# EAGLE board Arduino_fuer_LEDs_DCC_1.8 (EAGLE 9.6.2)
RELEASE_DATE: 07.11.22; RELEASE_VER: 1.8
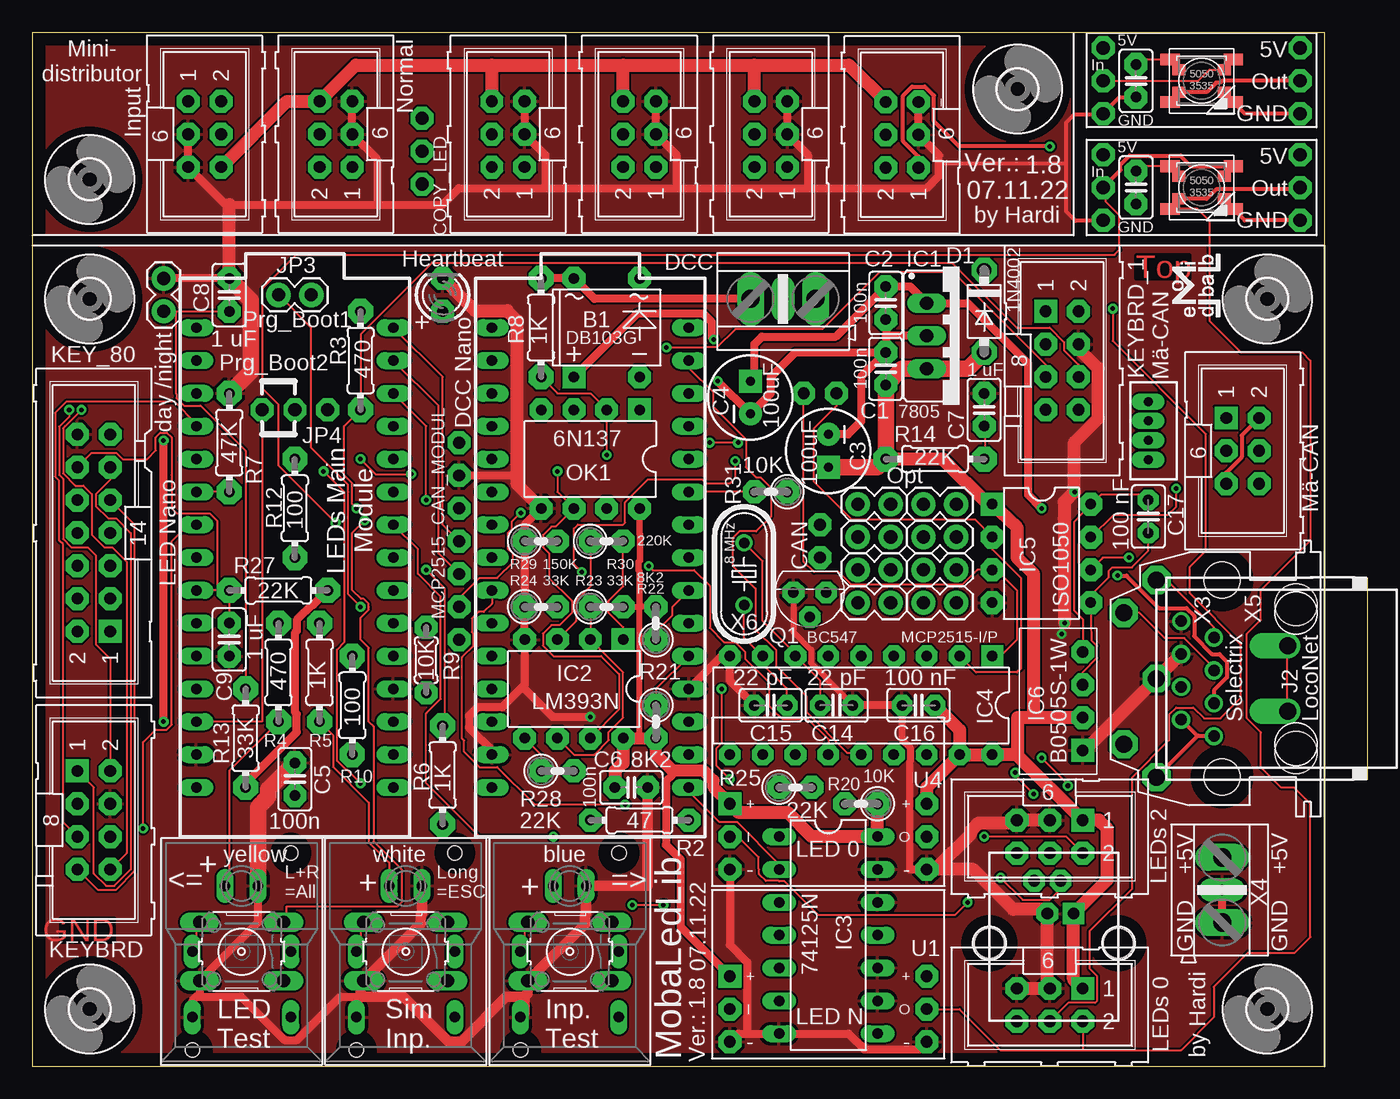
[diagram p2: board, top side]
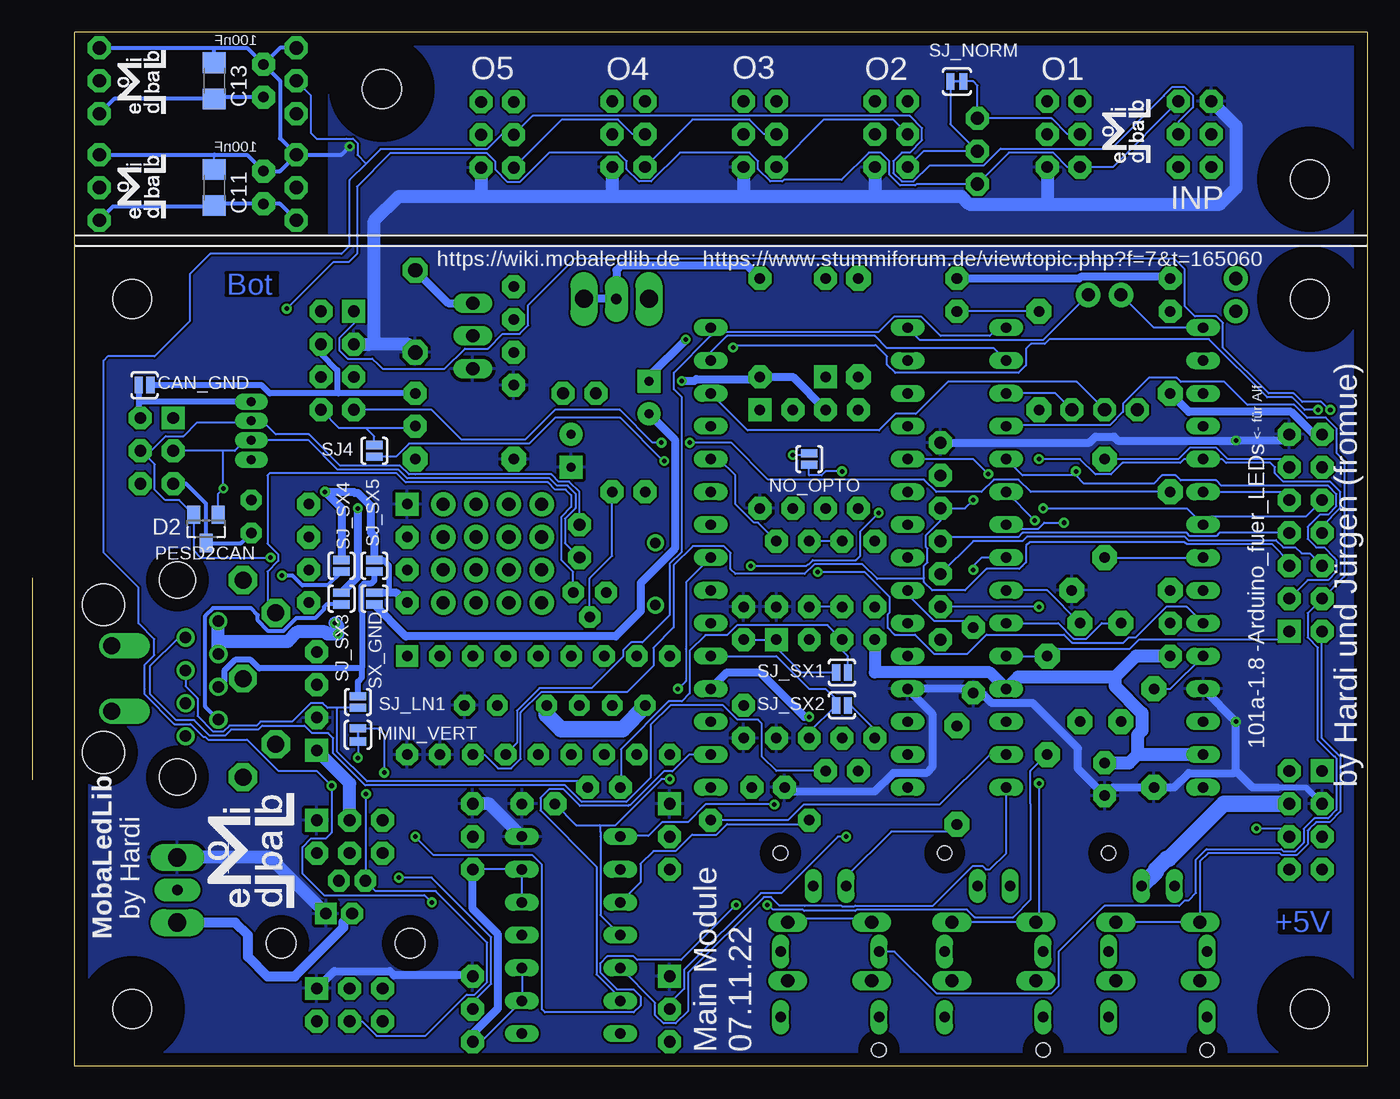
[diagram p3: board, bottom side, seen from below]

Size 100 x 80 mm. Coordinates in mm from the lower left corner, seen from the top.
Outline: 0,80 0,0 100,0 100,80 0,80
Copper layers (1*16): Top 0.035mm / dielectric 1.5mm / Bottom 0.035mm
Design rules "default *": minimum track width 6mil, minimum drill 0.35mm, track to track 6mil, track to pad 6mil, pad to pad 6mil, via to via 6mil, smd to smd 6mil, copper to edge 40mil, drill to drill 6mil, minimum pad ring 10mil, minimum via ring 8mil, stop-mask expansion 4mil, vias tented up to drill 0.5mm, thermal gap 10mil

## Footprints (pad centres in the part's own frame; a part is rotated, then mirrored left to right if it is on the bottom)
1X02 = drill 1.016 pad 1.88: 1 0,0; 2 2.54,0
DB = drill 0.813 pad 1.778 square: + -2.54,-3.81 | drill 0.813 pad 1.778 octagon: - 2.54,-3.81; AC1 2.54,3.81; AC2 -2.54,3.81
C025-025X050 = drill 0.813 pad 1.778 octagon: 1 -1.27,0; 2 1.27,0
SPARKFUN-CAPACITORS_CPOL-RADIAL-100UF-25V = drill 0.7 pad 1.778 square: 1 1.27,0 | drill 0.7 pad 1.778: 2 -1.27,0
C1206 = smd 1.6 x 1.8: 1 -1.4,0; 2 1.4,0
C2.5-2 = drill 0.813 pad 1.6 octagon: 1 -1.27,0; 2 1.27,0
MCP2515_CAN_MODUL = drill 0.914 pad 1.778 octagon: 1 0,0; 2 0,-2.54; 3 0,-5.08; 4 0,-7.62; 5 0,-10.16; 6 0,-12.7; 7 0,-15.24; 8 27.94,-6.35; 9 27.94,-8.89; 10 26.67,3.81; 11 29.21,3.81
SJ_2S-NO = smd 0.635 x 1.27: 1 -0.45,0; 2 0.45,0
1X03-CLEANBIG = drill 1.016 pad 1.778 octagon: 1 -2.54,0; 2 0,0; 3 2.54,0
B4B-ZR4P = drill 0.7 pad 1.27 long: 1 0,0; 2 1.5,0; 3 3,0; 4 4.5,0
DO41-10 = drill 1.118 pad 1.93 octagon: A 3.175,0; C -3.175,0
SOT23 = smd 1 x 1.4: 1 -0.95,-1.1; 2 0.95,-1.1; 3 0,1.1
3,0 = hole 3: 0,0
78XXS = drill 1.016 long: GND 0,-2.54; IN -2.54,-2.54; OUT 2.54,-2.54
DIL08 = drill 0.813 pad 1.778 square: 1 -3.81,-3.81 | drill 0.813 pad 1.778 octagon: 2 -1.27,-3.81; 3 1.27,-3.81; 4 3.81,-3.81; 5 3.81,3.81; 6 1.27,3.81; 7 -1.27,3.81; 8 -3.81,3.81
DIL14 = drill 0.813 long: 1 -7.62,-3.81; 2 -5.08,-3.81; 3 -2.54,-3.81; 4 0,-3.81; 5 2.54,-3.81; 6 5.08,-3.81; 7 7.62,-3.81; 8 7.62,3.81; 9 5.08,3.81; 10 2.54,3.81; 11 0,3.81; 12 -2.54,3.81; 13 -5.08,3.81; 14 -7.62,3.81
DIL18 = drill 0.813 pad 1.676 square: 1 -10.16,-3.81 | drill 0.813 pad 1.676 octagon: 2 -7.62,-3.81; 3 -5.08,-3.81; 4 -2.54,-3.81; 5 0,-3.81; 6 2.54,-3.81; 7 5.08,-3.81; 8 7.62,-3.81; 9 10.16,-3.81; 10 10.16,3.81; 11 7.62,3.81; 12 5.08,3.81; 13 2.54,3.81; 14 0,3.81; 15 -2.54,3.81; 16 -5.08,3.81; 17 -7.62,3.81; 18 -10.16,3.81
DCDC-TEA_NME = drill 0.9 pad 1.778 square: G_IN 0,0 | drill 0.9 pad 1.778 octagon: G_OUT 5.08,0; V_IN 2.54,0; V_OUT 7.62,0
ML6 = drill 0.914 pad 1.778 octagon: 1 -2.54,-1.27; 2 -2.54,1.27; 3 0,-1.27; 4 0,1.27; 5 2.54,-1.27; 6 2.54,1.27
RJ11-NO_SHIELD_NO_MOUNT_HOULE = drill 0.9 pad 1.4: 1 -3.175,8.89; 2 -1.905,6.35; 3 -0.635,8.89; 4 0.635,6.35; 5 1.905,8.89; 6 3.175,6.35
ML14 = drill 0.914 pad 1.778 square: 1 -7.62,-1.27 | drill 0.914 pad 1.778 octagon: 2 -7.62,1.27; 3 -5.08,-1.27; 4 -5.08,1.27; 5 -2.54,-1.27; 6 -2.54,1.27; 7 0,-1.27; 8 0,1.27; 9 2.54,-1.27; 10 2.54,1.27; 11 5.08,-1.27; 12 5.08,1.27; 13 7.62,-1.27; 14 7.62,1.27
CON-HARTING-ML_ML08 = drill 0.914 pad 1.778 square: 1 -5.08,-1.27 | drill 0.914 pad 1.778 octagon: 2 -5.08,1.27; 3 -2.54,-1.27; 4 -2.54,1.27; 5 0,-1.27; 6 0,1.27; 7 2.54,-1.27; 8 2.54,1.27
LED3MM = drill 0.813 pad 1.778 octagon: A -1.27,0; K 1.27,0
WS2812B = smd 1.5 x 0.9: 1-5V 2.45,-1.65; 2-DOUT 2.45,1.65; 3-GND -2.45,1.65; 4-DIN -2.45,-1.65
LED3535 = smd 1 x 0.85: 1_5V 1.75,-0.875; 2_DOUT 1.75,0.875; 3_GND -1.75,0.875; 4_DIN -1.75,-0.875
SJ_2S-TRACE = smd 0.635 x 1.27: 1 -0.508,0; 2 0.508,0
TO92 = drill 0.813 pad 1.676 octagon: 1 1.27,0; 2 0,1.905; 3 -1.27,0
0204/7 = drill 0.813 pad 1.778 octagon: 1 -3.81,0; 2 3.81,0
0204/7' = drill 0.813 pad 1.93 octagon: 1 -3.81,0; 2 3.81,0
0204/5 = drill 0.813 pad 1.778 octagon: 1 -2.54,0; 2 2.54,0
0207/2V = drill 0.813 pad 1.778 octagon: 1 -1.27,0; 2 1.27,0
B3F-10XX = drill 1.016 long: 1 -3.251,2.261; 2 3.251,2.261; 3 -3.251,-2.261; 4 3.251,-2.261
SRKL = drill 0.813 long: 1 -3.81,-5.08; 2 -3.81,0; 3 3.81,0; 4 3.81,-5.08; + -1.27,5.08; - 1.27,5.08 | hole 1.118: 3.81,7.62; -3.81,-7.62
ML6' = drill 0.914 pad 1.778 square: 1 -2.54,-1.27 | drill 0.914 pad 1.778 octagon: 2 -2.54,1.27; 3 0,-1.27; 4 0,1.27; 5 2.54,-1.27; 6 2.54,1.27
WS2812__BREAKOUT = drill 0.914 pad 1.778 square: 1 -7.62,2.54 | drill 0.914 pad 1.778 octagon: 2 -7.62,0; 3 -7.62,-2.54; 4 7.62,-2.54; 5 7.62,0; 6 7.62,2.54
NANO = drill 0.8 long: 3.3V -10.16,24.13; 5V -10.16,-1.27; A0 -10.16,19.05; A1 -10.16,16.51; A2 -10.16,13.97; A3 -10.16,11.43; A4 -10.16,8.89; A5 -10.16,6.35; A6 -10.16,3.81; A7 -10.16,1.27; AREF -10.16,21.59; D2 5.08,1.27; D3 5.08,3.81; D4 5.08,6.35; D5 5.08,8.89; D6 5.08,11.43; D7 5.08,13.97; D8 5.08,16.51; D9 5.08,19.05; D10 5.08,21.59; D11 5.08,24.13; D12 5.08,26.67; D13 -10.16,26.67; GND -10.16,-6.35; GND1 5.08,-1.27; RAW -10.16,-8.89; RST -10.16,-3.81; RST1 5.08,-3.81; RX1 5.08,-6.35; TX0 5.08,-8.89
RJ10 = drill 0.9 pad 1.676 square: 1 -1.524,-2.3 | drill 0.9 pad 1.676 octagon: 2 -0.508,-4.84; 3 0.508,-2.3; 4 1.524,-4.84 | hole 2.3: 5,0; -5,0
AK500/2+M = drill 1.397 long: 1 -2.515,0; 2 2.515,0 | drill 0.813 pad 1.778 long: M 0,0
MAB5SH = drill 1.321 pad 2.184 octagon: 1 7.62,5.08; 3 -7.62,5.08; 4 5.08,7.62; 5 -5.08,7.62 | drill 1.321 pad 2.134 octagon: 2 0,5.08 | drill 1.321 offset: PE -2.54,-5.08; PE@ 2.54,-5.08 | hole 2.794: 7.62,0; -7.62,0
RJ45_MEBP8-8S = drill 0.889: 1 -4.445,6.35; 2 -3.175,8.89; 3 -1.905,6.35; 4 -0.635,8.89; 5 0.635,6.35; 6 1.905,8.89; 7 3.175,6.35; 8 4.445,8.89 | hole 3.251: -5.715,0; 5.715,0
HC49U-V = drill 0.813: 1 -2.413,0; 2 2.413,0

## Placement (x,y rotation side)
A1  Opt  [1X02]  63.88,35.88 0 top
A2  Opt  [1X02]  68.96,35.88 0 top
A3  Opt  [1X02]  68.96,38.42 0 top
A4  Opt  [1X02]  63.88,38.42 0 top
A5  Opt  [1X02]  68.96,40.96 0 top
A6  Opt  [1X02]  63.88,40.96 0 top
A7  Opt  [1X02]  68.96,43.5 0 top
A8  Opt  [1X02]  63.88,43.5 0 top
B1  DB103G  [DB]  44.45,57.15 0 top
C1  100n  [C025-025X050]  66.04,53.98 90 top
C2  100n  [C025-025X050]  66.04,59.05 270 top
C3  100uF  [SPARKFUN-CAPACITORS_CPOL-RADIAL-100UF-25V]  61.59,47.62 270 top
C4  100uF  [SPARKFUN-CAPACITORS_CPOL-RADIAL-100UF-25V]  55.56,51.75 90 top
C5  100n  [C025-025X050]  20.32,22.23 90 top
C6  100n  [C025-025X050]  46.35,21.59 0 top
C7  1 uF  [C025-025X050]  73.66,50.8 90 top
C8  1 uF  [C025-025X050]  15.24,59.69 90 top
C9  1 uF  [C025-025X050]  15.24,33.02 270 top
C10  100nF  [C025-025X050]  85.41,67.99 270 top
C11  100nF  [C1206]  89.22,67.99 270 bottom
C12  100nF  [C025-025X050]  85.41,76.25 270 top
C13  100nF  [C1206]  89.22,76.25 270 bottom
C14  22 pF  [C2.5-2]  62.23,27.94 0 top
C15  22 pF  [C2.5-2]  57.15,27.94 180 top
C16  100 nF  [C2.5-2]  68.58,27.94 180 top
C17  100 nF  [C2.5-2]  86.36,42.55 270 top
CAN2  MCP2515_CAN_MODUL  [MCP2515_CAN_MODUL]  33.02,48.26 0 top
CAN_GND  SOLDERJUMPERNO  [SJ_2S-NO]  94.61,52.7 0 bottom
CON1  [1X03-CLEANBIG]  82.87,67.99 270 top
CON2  [1X03-CLEANBIG]  98.11,67.99 270 top
CON3  [1X03-CLEANBIG]  82.87,76.25 270 top
CON4  [1X03-CLEANBIG]  98.11,76.25 270 top
CON5  M04B4B-ZR4P  [B4B-ZR4P]  86.36,51.44 270 top
COPY_LED  [1X03-CLEANBIG]  30.16,70.8 270 top
D1  1N4002  [DO41-10]  73.66,58.42 270 top
D2  PESD2CAN  [SOT23]  89.85,41.59 180 bottom
H1  MOUNT-HOLE3.0  [3,0]  4.45,4.45 0 top
H2  MOUNT-HOLE3.0  [3,0]  4.45,59.37 0 top
H3  MOUNT-HOLE3.0  [3,0]  95.57,59.37 0 top
H4  MOUNT-HOLE3.0  [3,0]  95.57,4.45 0 top
H5  MOUNT-HOLE3.0  [3,0]  4.45,68.63 0 top
H6  MOUNT-HOLE3.0  [3,0]  76.25,75.61 0 top
IC1  7805  [78XXS]  71.75,56.52 270 top
IC2  LM393N  [DIL08]  41.91,29.21 180 top
IC3  74125N  [DIL14]  61.59,10.16 270 top
IC4  MCP2515-I/P  [DIL18]  64.14,27.94 180 top
IC5  ISO1050  [DIL08]  78.11,39.69 270 top
IC6  B0505S-1W  [DCDC-TEA_NME]  81.28,24.45 90 top
INP  [ML6]  13.34,72.12 270 top
J1  day /night  [1X02]  10.16,60.96 270 top
J2  LocoNet  [RJ11-NO_SHIELD_NO_MOUNT_HOULE]  97.79,30 90 top
JP3  Prg_Boot1  [1X02]  21.59,59.69 180 top
JP4  Prg_Boot2  [1X03-CLEANBIG]  20.32,50.8 0 top
KEY_80  [ML14]  4.76,41.27 90 top
KEYBRD  [CON-HARTING-ML_ML08]  4.76,17.78 270 top
KEYBRD_1  [CON-HARTING-ML_ML08]  79.69,53.34 270 top
LED1  Heartbeat  [LED3MM]  31.75,59.69 90 top
LED2  WS2812B5050  [WS2812B]  90.49,67.99 180 top
LED3  WS2812B5050  [WS2812B]  90.49,76.25 180 top
LED4  WS2812B3535  [LED3535]  90.49,67.99 180 top
LED5  WS2812B3535  [LED3535]  90.49,76.25 180 top
MINI_VERT  SOLDERJUMPERTRACE  [SJ_2S-TRACE]  78.11,25.65 90 bottom
NO_OPTO  SOLDERJUMPERNO  [SJ_2S-NO]  43.18,46.99 90 bottom
O1  [ML6]  23.5,72.12 90 top
O2  [ML6]  36.83,72.12 90 top
O3  [ML6]  46.99,72.12 90 top
O4  [ML6]  57.15,72.12 90 top
O5  [ML6]  67.31,72.07 90 top
OK1  6N137  [DIL08]  43.18,46.99 180 top
Q1  BC547  [TO92]  60.17,36.67 180 top
R2  47  [0204/7]  46.99,19.05 0 top
R3  470  [0204/7']  25.4,54.61 270 top
R4  470  [0204/7']  19.05,30.48 90 top
R5  1K  [0204/7']  22.23,30.48 90 top
R6  1K  [0204/7']  31.75,22.54 90 top
R7  47K  [0204/7']  15.24,48.26 270 top
R8  1K  [0204/7']  39.37,57.15 90 top
R9  10K  [0204/5]  30.48,31.43 270 top
R10  100  [0204/7']  24.77,27.94 90 top
R12  100  [0204/7']  20.32,43.18 90 top
R13  33K  [0204/7']  16.51,25.4 270 top
R14  22K  [0204/7']  69.85,46.99 180 top
R20  10K  [0207/2V]  64.14,20.32 180 top
R21  8K2  [0207/2V]  48.26,26.67 270 top
R22  8K2  [0207/2V]  48.26,34.29 90 top
R23  33K  [0207/2V]  44.45,35.56 0 top
R24  33K  [0207/2V]  39.37,35.56 0 top
R25  22K  [0207/2V]  59.05,21.59 0 top
R27  22K  [0204/7']  19.05,36.83 0 top
R28  22K  [0207/2V]  40.64,22.86 0 top
R29  150K  [0207/2V]  39.37,40.64 0 top
R30  220K  [0207/2V]  44.45,40.64 0 top
R31  10K  [0207/2V]  57.15,44.45 180 top
S1  [B3F-10XX]  16.19,8.89 180 top
S2  [B3F-10XX]  28.89,8.89 180 top
S3  [B3F-10XX]  41.59,8.89 180 top
S4  yellow  [SRKL]  16.19,8.89 0 top
S5  white  [SRKL]  28.89,8.89 0 top
S6  blue  [SRKL]  41.59,8.89 0 top
SJ4  SOLDERJUMPERNO  [SJ_2S-NO]  76.83,47.62 90 bottom
SJ_LN1  SOLDERJUMPERNO  [SJ_2S-NO]  78.11,28.19 270 bottom
SJ_NORM  SOLDERJUMPERTRACE  [SJ_2S-TRACE]  31.75,76.2 0 bottom
SJ_SX1  SOLDERJUMPERNO  [SJ_2S-NO]  40.64,30.48 180 bottom
SJ_SX2  SOLDERJUMPERNO  [SJ_2S-NO]  40.64,27.94 180 bottom
SJ_SX3  SOLDERJUMPERNO  [SJ_2S-NO]  79.38,36.2 90 bottom
SJ_SX4  SOLDERJUMPERNO  [SJ_2S-NO]  79.38,38.73 90 bottom
SJ_SX5  SOLDERJUMPERNO  [SJ_2S-NO]  76.83,38.73 90 bottom
SV1  Mä-CAN  [ML6']  93.66,47.62 270 top
SV2  LEDs 2  [ML6']  78.74,17.78 180 top
SV3  LEDs 0  [ML6']  78.74,4.76 180 top
SX_GND  SOLDERJUMPERNO  [SJ_2S-NO]  76.83,36.2 90 bottom
U1  WS2812_BREAKOUT  [WS2812__BREAKOUT]  61.59,4.45 0 top
U2  LED NANO  [NANO]  22.86,30.48 0 top
U3  DCC NANO  [NANO]  45.72,30.48 0 top
U4  WS2812_BREAKOUT  [WS2812__BREAKOUT]  61.59,17.78 0 top
U$1  ESP_ADAPTER  [ESP_ADAPTER]  12.7,21.59 0 top
X1  RJ10  [RJ10]  79.06,9.53 180 top
X2  AK500/2+M  [AK500/2+M]  58.1,59.37 180 top
X3  MAB 5SH Conrad: 738247 - VQ  [MAB5SH]  92.08,30 90 top
X4  AK500/2+M  [AK500/2+M]  92.08,13.65 90 top
X5  Reichelt MEBP 8-8S  [RJ45_MEBP8-8S]  97.79,30 90 top
X6  8 MHz  [HC49U-V]  55.09,38.1 270 top

## Tracks (layer width: path | path; a pad name or v marks a point on that pad's centre or on a via)
+5V  (via drill 0.35)
  Top 0.152: LED4.1_5V 88.7,68.89 88.09,69.49 LED2.1-5V 85.79,69.64 C10.1 | C12.1 85.79,77.9 LED3.1-5V
  Top 0.305: LED3.1-5V 88.74,77.2 LED5.1_5V | O5.1 68.58,70.38 67.39,71.58 67.39,75.11 68.09,75.81 69.07,75.81 69.77,75.11 69.77,73.1 71.71,71.17 v78.74,71.17
  Top 0.457: 46.99,25.4 46.99,35.56 | R22.2 46.99,35.56 | R23.2 46.99,35.56
  Top 0.508: OK1.8 46.99,41.2 47.02,41.18 47.02,39.13 46.92,39.03 46.92,38.38 46.99,38.31 46.99,35.56
  Top 0.61: R27.2 21.74,35.71 21.64,35.71 20.47,34.55 20.47,33.7 20.32,33.55 20.32,27.41 20.47,27.26 20.47,25.87 16.51,21.91 R13.2 | v10.16,26.67 v10.16,48.42 | 49.53,22.86 49.53,22.55 49.03,22.05 49.03,17.14 50.16,16.02 50.16,10.79 U1.1
  Top 0.914: U4.1 52.72,21.58 52.72,22.11 51.97,22.86 49.53,22.86 48.26,24.13 R21.2 46.99,25.4 IC2.8
  Top 1.016: C16.1 71.75,26.04 IC4.17 | IC4.17 IC4.18 76.2,24.13 | U4.1 54.66,19.63 58.46,19.63 60.31,17.78 IC3.14 R20.1 | C6.1 45.09,22.86 45.72,23.5 IC2.8 | R14.2 70.48,46.99 73.98,43.5 IC5.1 76.17,41.7 76.2,41.67 76.2,39.37 77.47,38.1 77.47,26.99 | IC6.V_IN 77.47,26.99 | 77.47,26.99 76.24,26.99 76.24,24.17 76.2,24.13 | 76.2,24.13 SV2.1 82.55,19.05 83.19,18.41 83.19,14.43 X1.1 80.58,6.73 SV3.1 | U4.6 69.22,21.59 IC4.17
  Top 1.27: C3.1 65.41,46.35 R14.2 C1.1 67.31,53.98 IC1.OUT 72.39,53.98 D1.A
  Bottom 0.152: C10.1 86.68,70.53 89.22,70.53 89.22,70.48 C11.1
  Bottom 0.305: CON2.1 89.22,70.53 | 89.22,70.48 86.63,70.48 C10.1 84.14,69.26 CON1.1 | CON4.1 89.22,78.79 | 89.22,78.79 86.68,78.79 C12.1 | C13.1 89.22,78.79 | CON3.1 84.14,78.79 C12.1 | C12.1 84.14,76.25 84.14,71.8 CON1.1 | CON1.1 79.38,70.53 v78.74,71.17
  Bottom 0.457: KEYBRD.3 4.76,21.59 6.99,21.59
  Bottom 0.61: CAN2.1 21.49,48.26 21.04,48.72 19.61,48.72 19.31,48.42 v10.16,48.42 6.51,48.42 KEY_80.13 | U2.5V v10.16,26.67 10.16,22.86 | 10.16,22.86 10.32,22.7 13.81,22.7 14.93,21.59 R13.2 19.68,21.59 C5.1 22.38,23.02 22.38,24.61 25.88,28.1 29.05,28.1 29.85,28.89 R9.2 30.8,29.21 U3.5V 33.66,27.3 33.66,23.18 34.13,22.7 36.67,22.7 38.1,21.27 44.77,21.27 C6.1 | 10.16,22.86 8.89,21.59 6.99,21.59 | SV3.1 79.93,7.38 75.64,7.38 75.32,7.05 69.28,7.05 U1.6
  Bottom 1.016: X1.1 84.92,16.17 X4.2 | IC3.14 67.94,20.32 U4.6 | D1.A 74.3,55.88 77.15,55.88 | KEYBRD_1.3 77.15,55.88 | 77.15,55.88 76.83,56.2 76.83,65.41 74.93,67.31 68.58,67.31 | 24.77,66.71 30.8,66.71 31.4,67.31 38.1,67.31 | 24.77,66.71 11.39,66.71 10.16,67.94 10.16,72.75 INP.1 | 68.58,67.31 58.55,67.31 | 58.55,67.31 48.26,67.31 | 48.26,67.31 38.1,67.31 | O1.1 24.77,66.71 | O2.1 38.1,67.31 | O3.1 48.26,67.31 | O4.1 58.42,67.44 58.55,67.31 | O5.1 68.58,67.31
  pour Bottom: 0,62.23 1.27,63.5 1.91,63.5 97.16,63.5 100.33,60.33 100.33,2.54 97.79,0 1.91,0 0,1.91 0,2.54
  pour Bottom: 0.95,64.45 80.33,64.45 80.33,79.06 79.38,80.01 0.95,80.01 0,79.06 0,65.41
A1  (via drill 0.35)
  Top 0.152: v25.4,46.99 26.56,45.83 v29.32,45.83
  Bottom 0.152: v29.32,45.83 30.48,46.99 U3.A1 | v25.4,46.99 22.23,46.99 21.03,45.8 19.83,45.8 18.94,46.69 14.48,46.69 14.17,46.99 U2.A1 11.23,46.99 10.92,46.69 7.48,46.69 7.15,46.35 7.15,45.89 6.5,45.24 2.86,45.24 2.07,44.45 2.07,43.23 3.49,41.8 KEY_80.8
A7
  Top 0.152: J1.2 11.11,58.42 | 11.11,58.42 C8.1 | R13.1 16.51,47.62 13.02,51.12 11.75,51.12 11.16,51.7 11.16,52.02 11.11,52.07 11.11,58.42
  Bottom 0.152: U2.A7 15.24,29.21 R13.1
BUTTONS  (via drill 0.35)
  Top 0.152: KEYBRD.7 5.08,13.65 6.35,13.65 6.36,13.66 6.48,13.66 7.94,15.13 7.94,41.91 KEY_80.9 | R7.2 U2.A2 | v54.61,48.26 v52.43,48.26
  Bottom 0.152: KEY_80.9 6.67,44.45 U2.A2 | R7.2 26.04,44.45 26.99,45.4 28.89,45.4 29.84,44.45 33.34,44.45 34.29,45.4 46.35,45.4 49.21,48.26 v52.43,48.26 | v54.61,48.26 55.3,48.26 57.84,50.8 62.87,50.8 65.18,48.49 70.08,48.49 72.39,50.8 KEYBRD_1.7
CAN_H  (via drill 0.35)
  Top 0.152: IC5.7 83.69,42.67 87.88,42.67 88.52,43.31 v88.52,44.7
  Bottom 0.152: CAN2.9 62.08,40.49 62.08,42.37 61.27,43.19 61.27,44.32 61.87,44.93 62.7,44.93 63.26,45.49 74.28,45.49 74.97,46.18 79.66,46.18 81.92,48.44 CON5.3 86.82,48.44 87.63,47.62 88.52,47.62 | 88.52,47.62 SV1.3 | 88.52,47.62 v88.52,44.7 88.9,44.32 D2.1
CAN_L  (via drill 0.35)
  Top 0.152: v84.86,39.37 82.83,39.37 82.77,39.31 82.77,39.27 IC5.6
  Bottom 0.152: 94.49,47.24 94.79,47.55 SV1.4 94.49,47.24 | 94.49,47.24 92.96,48.77 91.59,48.77 90.53,49.84 86.41,49.84 CON5.2 85.5,49.94 84.45,48.9 81.89,48.9 79.48,46.48 74.84,46.48 74.15,45.8 73.66,45.8 63.14,45.8 62.58,45.24 61.75,45.24 60.96,44.45 CAN2.8 | 94.49,47.24 93.81,46.57 93.81,44.6 93.03,43.81 91.92,43.81 D2.2 90.8,39.92 90.25,39.37 v84.86,39.37
CAN_VCC
  Top 0.152: C17.1 85.83,44.21 82.69,44.21 IC5.8 80.61,42.11 80.61,35.29 81.28,34.61 IC6.V_OUT
CLOCK_K
  Top 0.152: U2.A0 12.7,49.74 11,51.44 2.63,51.44 1.76,50.57 1.76,45.63 2.07,45.33 2.07,40.69 2.38,40.38 2.38,18.9 KEYBRD.5
D2
  Bottom 0.152: KEY_80.1 6.67,33.02 17.67,33.02 18.4,32.28 24.23,32.28 R10.2 U2.D2
D2_2  (via drill 0.35)
  Top 0.152: v40.64,46.04 40.64,44.45 OK1.6 40.49,41.76 40.18,41.76 39.52,41.1 39.52,40.18 40.01,39.69 40.01,37.78 41.76,36.02 41.76,35.1 40.8,34.14 40.18,34.14 39.52,33.48 39.52,32.56 40.33,31.75 44.02,31.75 45.41,30.35 45.41,27.64 IC2.7 | U3.D2 48.26,29.21 R21.1
  Bottom 0.152: v40.64,46.04 41.91,46.04 42.23,45.72 43.18,45.72 NO_OPTO.1 | U3.D2 45.72,31.75 43.18,29.21 41.91,29.21 41.09,28.39 SJ_SX2.2 43.18,25.85 IC2.7
D3
  Bottom 0.152: R4.2 20.54,34.29 21.73,33.1 22.72,33.1 23.91,34.29 U2.D3
D4
  Bottom 0.152: R5.2 24.77,36.83 U2.D4
D5  (via drill 0.35)
  Top 0.152: v30.48,38.42 31.9,36.99 31.9,26.5 R6.2
  Bottom 0.152: U2.D5 29.84,39.37 30.48,38.73 v30.48,38.42
D6  (via drill 0.35)
  Top 0.152: U2.D6 29.84,40.01 29.84,38.1 31.6,36.35 31.6,28.43 30.48,27.31 30.48,21.91 34.61,17.78 v40.32,17.78 | LED4.4_DIN 92.24,68.94 LED2.4-DIN | v23.47,42.06 19.05,46.48 19.05,51.21 17.83,52.43 17.83,60.2 20.42,62.79 83.74,62.79 84.12,63.17 84.12,65.84 83.06,66.9 83.06,67.97 CON1.2
  Top 0.305: CON1.2 84.21,69.34 84.21,69.76 84.91,70.46 88.86,70.46 89.67,69.64 LED2.4-DIN
  Bottom 0.152: v23.47,42.06 24.99,42.06 25.45,41.6 27.58,41.6 27.89,41.91 U2.D6 | U1.2 53.98,4.88 52.86,6 52.86,7.47 46.92,13.41 45.34,13.41 40.97,17.78 v40.32,17.78
D7  (via drill 0.35)
  Top 0.152: S4.2 12.7,9.21 12.7,11.11 S1.4 | S1.3 19.68,11.43 19.68,12.38 28.26,12.38 28.57,12.7 28.57,15.24 26.4,17.41 26.4,26.3 26.04,26.67 26.04,32.38 25.4,33.02 25.4,34.7 26.04,35.34 26.04,35.56 26.01,35.59 26.01,35.81 25.65,36.17 25.43,36.17 24.77,36.83 24.77,41.27 v25.72,42.23
  Bottom 0.152: v25.72,42.23 U2.D7 | S1.3 S1.4 12.94,15.88 12.31,16.51 6.77,16.51 6.62,16.36 5.44,16.36 4.61,17.19 4.61,18.25 4.45,18.41 4.44,18.41 3.96,18.9 2.9,18.9 2.07,19.73 2.07,23.97 2.38,24.28 2.39,24.28 3.5,25.4 3.5,33.64 KEY_80.2
D7_2
  Top 0.152: R31.2 U3.D7
D8  (via drill 0.35)
  Top 0.152: S5.2 25.4,9.21 25.4,11.11 S2.4 | v22.54,46.04 24.13,44.45 24.13,32.8 23.57,32.24 23.57,23.64 24.27,22.94 24.37,22.94 v25.4,21.91
  Bottom 0.152: U2.D8 26.67,45.72 22.54,45.72 | v25.4,21.91 25.4,11.43 S2.4 S2.3 | 22.54,45.72 v22.54,46.04 | KEY_80.3 4.61,37.62 3.03,37.62 2.38,38.27 2.38,39.2 2.54,39.36 2.54,39.37 3.33,40.16 3.96,40.16 4.61,40.81 4.61,41.74 4.45,41.9 4.45,41.91 3.66,42.7 3.03,42.7 2.38,43.35 2.38,44.28 3.03,44.93 11.28,44.93 11.68,45.33 14.43,45.33 14.82,45.72 15.88,45.72 16.51,45.09 21.91,45.09 22.54,45.72
D9
  Top 0.152: S6.2 38.1,9.21 38.1,11.11 S3.4
  Bottom 0.152: S3.3 44.77,11.43 38.42,11.43 S3.4 | S6.2 36.57,8.89 33.32,5.64 24.47,5.64 23.89,6.22 23.89,8.87 20.34,12.42 14.55,12.42 14.12,12.85 13.82,12.85 13.25,13.42 13.25,16 12.43,16.82 6.65,16.82 6.5,16.66 5.57,16.66 4.92,17.32 4.92,18.38 4.09,19.2 3.03,19.2 2.38,19.86 2.38,23.84 2.51,23.98 2.54,23.98 3.81,25.25 3.81,32.39 4.61,33.19 4.61,35.08 KEY_80.4 1.76,37.92 1.76,46.85 2.38,47.46 2.38,49.36 3.17,50.16 4.64,50.16 5.65,51.17 9.27,51.17 11.04,52.95 14.43,52.95 14.75,53.26 16.9,53.26 18.9,51.26 18.9,50.64 19.93,49.61 27.86,49.61 U2.D9
D10  (via drill 0.35)
  Top 0.152: U2.D10 30.48,49.53 v30.48,43.81
  Bottom 0.152: U2.D10 24.13,52.07 JP4.3 | v30.48,43.81 31.11,43.18 CAN2.3 33.02,42.22 34.14,41.1 34.14,40.18 34.02,40.06 34.02,39 34.29,38.74 34.29,37.78 | IC4.16 69.19,24.08 68.28,24.08 67.26,23.06 66.23,23.06 65.5,23.8 65.5,27.4 63.93,28.97 57.26,28.97 55.24,30.99 55.24,32.38 53.67,33.96 53.67,38.77 52.19,40.25 49.78,40.25 49.26,39.74 49.26,38.47 48.9,38.1 43.53,38.1 42.77,38.86 39.06,38.86 37.92,37.71 34.36,37.71 34.29,37.78 | 34.29,37.78 34.29,37.47 33.66,36.83 31.11,36.83 29.46,38.49 26.92,38.49 26.67,38.73 26.4,39 26.4,40.27 26.11,40.56 14.12,40.56 13.97,40.42 7.4,40.42 6.03,39.05 KEY_80.5
D11
  Top 0.152: U2.D11 31.43,51.12 31.43,39.69 CAN2.5 | U3.D11 50.9,54.56 50.9,53.95 52.7,52.15 52.7,51.02 55.22,48.51 55.22,46.35 56,45.57 56.34,45.57 57.15,44.76 57.15,42.55 56.01,41.4 54.72,41.4 54.2,40.88 54.2,38.73 55.98,36.96 55.98,33.8 57.58,32.19 57.58,30.96 59.89,28.65 59.89,27.43 63.09,24.23 64.01,24.23 IC4.14
  Bottom 0.152: U2.D11 28.89,55.56 37.15,55.56 38.1,56.52 49.53,56.52 50.8,55.24 U3.D11 | KEY_80.6 4.45,39.69 5.08,39.69 5.55,40.16 6.5,40.16 7.06,40.72 13.85,40.72 14.09,40.97 26.34,40.97 26.67,40.64 30.48,40.64 CAN2.5
D12
  Top 0.152: U2.D12 31.75,53.34 31.75,41.91 CAN2.4
  Bottom 0.152: CAN2.4 32.7,40.96 26.99,40.96 26.67,41.27 13.97,41.27 13.72,41.03 11.68,41.03 11.43,41.27 KEY_80.7 | IC4.15 66.6,24.23 65.8,25.03 65.8,27.52 64.05,29.27 60.02,29.27 57.58,31.71 57.58,32.19 56.96,32.82 56.08,32.82 53.98,34.92 53.98,38.89 53.03,39.84 53.03,51.76 53.65,52.38 53.65,53.67 50.8,56.51 U3.D12 50.49,56.84 37.77,56.84 36.58,58.03 34.54,58.03 33.02,56.52 29.21,56.52 28.57,57.15 U2.D12
D13  (via drill 0.35)
  Top 0.152: v25.4,35.56 24.45,36.51 24.45,44.45 24.43,44.46 24.43,45 21.59,47.85 21.59,57.15 JP3.2 | v47.7,38.71 48.01,38.41 51.21,38.41 52.43,37.19 52.43,33.93 53.54,32.82 54.42,32.82 55.17,32.06 55.17,31.55 57,29.72 57,27.89 57.68,27.2 57.7,27.2 57.99,26.91 59.98,26.91 61.59,25.3 IC4.13 | CAN2.6 33.07,35.66 33.07,36.27 34.59,37.8 35.97,37.8 37.19,39.01 37.19,39.65 36.83,40.01 36.83,41.28 37.1,41.54 37.1,42.13 v37.8,42.82
  Bottom 0.152: v25.4,35.56 CAN2.6 | v47.7,38.71 43.43,38.71 43.29,38.85 43.21,38.85 42.9,39.16 39.58,39.16 39.22,39.52 39.22,41.4 v37.8,42.82 | U2.D13 16.51,57.15 JP3.2
D48_2
  Top 0.152: IC2.1 45.72,33.98 44.6,35.1 44.6,36.02 45.72,37.14 R30.2 | R22.1 48.26,33.66 49.53,34.92 49.53,35.56 U3.D4
  Bottom 0.152: 46.04,32.7 46.35,33.02 R22.1 | 46.04,32.7 43.81,30.48 SJ_SX1.2 | 46.04,32.7 IC2.1 | R30.2 47.14,42.06 47.45,42.06 48.9,43.5 48.9,45.72 50.16,46.99 U3.D8
DCC/SX_GND  (via drill 0.35)
  Top 0.61: C2.2 66.04,56.52 | 66.04,56.52 C1.2 | IC1.GND 66.04,56.52 | C1.2 64.14,53.34 64.14,49.91 63.12,48.9 C3.2 | v53.03,53.03 53.03,53.01 C4.2 57.15,52.07 57.15,53.34 59.05,55.24 C1.2
  Bottom 0.61: v53.03,53.03 52.06,53.03 51.91,53.18 47.15,53.18 B1.- 44.45,53.34 OK1.3 | C4.2 53.57,48.49 53.57,40.06 56.2,37.42 56.2,35.24 58.17,33.27 74.41,33.27 SX_GND.1
DT0  (via drill 0.35)
  Top 0.152: LED4.2_DOUT 88.04,66.42 LED2.2-DOUT 90.17,66.34 91.11,65.4 91.11,57.66 93.53,55.23 98.28,55.23 98.91,54.61 98.91,40.68 95.07,36.84 95.07,34.55 93.95,33.43 93.95,26.96 95.07,25.84 95.07,23.16 96.66,21.57 97.66,21.57 98.91,20.32 98.91,10.01 97.7,8.8 94.07,8.8 91.43,6.16 91.43,3.8 88.9,1.27 81.28,1.27 | 81.28,1.27 74.93,1.27 71.75,4.45 U1.5 | SV3.2 81.28,1.27 | v74.93,14.61 76.64,12.89 78.74,12.89 79.57,13.72 X1.2
  Top 0.305: LED4.2_DOUT 90.88,67.12 91.61,67.85 97.96,67.85 CON2.2
  Bottom 0.152: v74.93,14.61 72.39,14.61 67.79,10.01 67.79,6.4 69.22,4.97 U1.5
GND  (via drill 0.35)
  Top 0.152: 38.42,6.67 S3.2 | LED4.3_GND 92.94,66.42 LED2.3-GND
  Top 0.305: CON2.3 93.83,65.45 LED2.3-GND | CON4.3 93.83,73.71 LED3.3-GND 92.94,74.67 LED5.3_GND | CON1.3 82.82,65.41 80.73,65.41 80.01,66.12 80.01,69.85 | C12.2 84.14,74.98 CON3.3 82.82,73.66 80.64,73.66 80.01,73.03 80.01,69.85 | 80.01,69.85 70.17,69.85
  Top 0.457: C14.2 61.42,30.02 61.42,30.06 60.27,31.2 60.27,32.26 58.9,33.63 Q1.1
  Top 0.559: C16.2 67.31,25.29 67.94,24.66 67.94,23.6 67.89,23.55 67.89,15.29 67.94,15.24
  Top 0.61: S4.1 12.38,5.08 12.7,5.4 | 12.7,5.4 12.94,5.64 S1.2 17.46,11.15 S4.- | 12.7,5.4 16.17,5.4 19.54,2.03 20.46,2.03 23.83,5.4 25.4,5.4 | OK1.5 38.1,41.91 R29.1 R24.1 IC2.4 38.1,29.52 37.94,29.37 | 37.94,29.37 36.36,27.78 34.45,27.78 33.8,27.13 33.8,26.21 35.56,24.45 U3.GND | C8.2 J1.1 | CAN2.2 37.53,45.72 | O2.5 O2.3 39.69,70.53 39.69,67.94 | O3.5 O3.3 49.85,70.53 49.85,67.94 | O4.5 O4.3 60.01,70.53 60.01,67.94 | O5.5 O5.3 70.17,70.48 70.17,69.85 70.17,68.9 69.22,67.94 60.01,67.94 | O1.5 O1.3 26.67,70.22 26.67,66.67 | 39.69,67.94 33.02,67.94 31.75,66.67 26.67,66.67 | 39.69,67.94 49.85,67.94 | 49.85,67.94 60.01,67.94 | 26.67,66.67 15.24,66.67 14.97,66.67 INP.5 INP.3 | 69.85,15.24 U4.4 67.94,15.24 | C16.2 C14.2 | C15.2 53.98,29.84 IC4.9 53.34,31.75 U3.GND1 | X4.1 X4.M | U1.3 54.61,2.54 55.4,2.54 | 55.4,2.54 IC3.7 63.16,2.54 64.38,1.32 68.63,1.32 U1.4 | 55.4,2.54 55.32,2.62 55.32,8.06 53.98,9.41 U4.3 | 37.94,29.37 40.26,27.05 v43.18,27.05
  Top 0.813: C6.2 47.62,13.97 S6.- 42.86,11.8 42.76,11.7 42.76,11.01 38.42,6.67 | S3.2 38.34,5.64 38.1,5.4 | 38.1,5.4 38.1,4.13 S6.1 | 38.1,5.4 36.67,5.4 33.21,1.93 32.2,1.93 28.73,5.4 25.4,5.4 | S5.1 25.08,5.08 25.4,5.4 | 25.4,5.4 25.4,6.39 S2.2 30.06,11.05 30.06,11.7 30.16,11.8 S5.-
  Top 1.016: LED1.K 34.25,58.46 36.76,58.46 37.53,57.69 37.53,45.72 37.53,45.02 OK1.5 | v79.87,34.29 79.87,42.1 79.86,42.39 79.86,43.67 v80.64,44.45 80.64,48.29 82.51,50.16 82.51,53.98 80.96,55.53 KEYBRD_1.4 | J2.5 X3.2 81.44,24.45 IC6.G_IN | SV2.3 SV2.5 75.97,18.82 73.23,18.82 72.62,18.21 72.62,18.01 69.85,15.24 72.83,15.24 75.91,12.15 78.22,12.15 X1.3 78.55,6.22 SV3.3 SV3.5 | C8.2 15.24,66.67
  Top 1.27: C8.2 16.92,59.28 16.92,53.75 R7.1 | C5.2 18.26,21.44 18.26,20.86 17.46,20.06 S4.-
  Bottom 0.152: U4.4 IC3.13 IC3.12 | U1.4 68.58,1.91 IC3.9 IC3.10
  Bottom 0.305: CON1.3 84.14,66.72 C10.2 89.09,66.72 C11.2 89.27,66.54 97.02,66.54 CON2.3 | C12.2 89.09,74.98 C13.2 96.97,74.85 CON4.3
  Bottom 0.406: SJ_SX5.2 76.14,39.19 75.69,38.73 75.69,36.67
  Bottom 0.457: KEYBRD_1.4 80.96,55.14 79.69,53.87 79.69,52.13 79.63,52.07 | C7.2 79.63,52.07 | 79.63,52.07 84.92,52.07 85.56,52.7 CAN_GND.2
  Bottom 0.61: LED1.K 22.3,60.96 22.17,61.09 15.37,61.09 C8.2 | R7.1 13.81,50.64 5.88,50.64 4.13,48.9 KEY_80.14 | U4.4 69.22,12.18 67.26,10.23 67.26,4.5 69.22,2.54 U1.4 | v43.18,27.05 43.56,27.05 46.99,30.48 49.53,30.48 U3.GND1 | SX_GND.2 76.2,36.66 75.69,36.67 75.15,36.68 IC5.4 | SJ_SX4.2 79.38,43.18 v80.64,44.45 78.4,44.45 78.32,44.38 78.12,44.38 77.1,43.36 77.1,41.32 76.83,41.05 SJ_SX5.2
  Bottom 0.762: X1.3 79.21,11.16 79.21,10.77 83,6.98 85.11,6.98 86.61,8.47 86.61,10.16 87.58,11.14 X4.1
  Bottom 0.914: U2.GND1 29.22,30.49 38.1,30.49 IC2.4
  Bottom 1.016: C9.2 17.89,31.75 19.52,30.12 | U2.GND1 27.03,30.12 19.52,30.12 | 19.52,30.12 19.52,29.44 17.42,27.34 17.42,26 17.78,25.64 17.78,24.13 | C5.2 18.41,23.5 17.78,24.13 | U2.GND 17.78,24.13 | SV2.3 78.74,21.91 IC6.G_IN | J2.5 88.9,32.89 | 88.9,32.89 X5.8 | 88.9,32.89 88.88,32.87 83.54,32.87 82.8,33.62 80.64,33.62 80.48,33.45 v79.66,33.45 79.66,34.08 v79.87,34.29
  Bottom 1.27: C14.2 63.5,27.22 62.38,26.1 57.63,26.1 55.88,27.85 C15.2 | KEYBRD.4 11.11,20.32 15.35,16.08 15.52,16.08 16.37,15.23 16.37,15.06 S4.-
  pour Top: 0,63.5 99.69,63.5 99.69,0 0,0
  pour Top: 0,64.45 80.33,64.45 80.33,80.01 0,80.01
GND2
  Top 0.152: IC6.G_OUT 81.28,30.49 82.4,31.61 82.4,32.53 81.98,32.95 IC5.5 81.92,36.45 83.31,37.85 83.31,38.35 83.57,38.61 85.09,38.61 86.36,39.88 C17.2
  Top 0.305: SV1.2 93.59,48.82 93.59,47.13 92.39,45.94 SV1.5
  Bottom 0.152: 89.88,40.48 D2.3
  Bottom 0.305: SV1.2 | 89.88,40.48 89.88,43.56 91.41,45.09 SV1.5 | D2.3 87.14,40.49 C17.2
  Bottom 0.457: CAN_GND.1 95.06,51.44 | 95.06,51.44 95.06,50.31 SV1.2 | CON5.1 95.06,51.44
LEDS_K_SDA
  Top 0.152: KEYBRD.1 4.76,21.59 4.76,14.92 5.71,13.97 6.35,13.97 6.35,13.98 7.62,15.25 7.62,41.27 6.5,42.39 5.87,42.39 4.92,43.35 4.92,44.28 6.03,45.4 KEY_80.11
  Bottom 0.152: KEY_80.11 6.67,46.99 10.8,46.99 11.68,47.87 13.72,47.87 14.6,46.99 R12.2
MV_IN  (via drill 0.35)
  Top 0.152: v83.62,58.62 83.62,56.13 90.83,48.92 90.83,39.9 89.59,38.66 89.59,36.59 93.53,32.64 93.53,28.51 91.95,26.92 90.68,26.92 89.84,27.76 88.51,27.76 87.97,27.21 87.97,25.22 85.09,22.35 85.09,13.73 81.81,10.45 81.81,7.6 82.4,7.02 82.4,5.05 82.26,4.92 80.16,4.92 SV3.4 | v77.47,21.08 76.1,22.5 v76.07,22.73
  Bottom 0.152: INP.2 19.68,69.58 O1.2 23.18,69.58 24.3,70.7 27.73,70.7 COPY_LED.3 34.87,68.26 34.97,68.16 36.15,68.16 36.98,68.99 36.98,70.04 37.64,70.7 38.56,70.7 40.68,68.58 45.14,68.58 45.26,68.46 46.18,68.46 47.14,69.42 47.14,70.04 47.8,70.7 53.18,70.7 55.42,68.46 56.34,68.46 57.3,69.42 57.3,70.04 57.96,70.7 63.29,70.7 65.58,68.42 66.5,68.42 67.46,69.37 67.46,70 68.12,70.65 75.6,70.65 78.18,68.07 78.18,62.87 78.82,62.23 80.01,62.23 v83.62,58.62 | SV3.4 77.78,3.49 76.66,2.38 72.87,2.38 69.68,5.56 69.06,5.56 68.1,6.52 68.1,9.58 72.08,13.56 76.73,13.56 X1.4 77.47,14.43 v77.47,21.08 | MINI_VERT.2 76.58,26.16 76.07,25.65 v76.07,22.73
MV_OUT  (via drill 0.35)
  Top 0.152: U4.2 54.61,17.78 56.2,16.19 56.2,15.28 56.24,15.24 56.24,14.87 56.76,14.35 57.76,14.35 57.78,14.33 58.22,14.33 60.81,11.73 71.42,11.73 v72.39,12.7 | CON3.2 90.22,76.25 91.09,77.12 LED5.4_DIN | v78.11,23.88 80.14,21.84 v80.14,21.72
  Top 0.305: LED5.4_DIN 92.94,77.82 LED3.4-DIN
  Bottom 0.152: INP.4 14.61,73.08 13.49,74.2 13.49,75.12 14.14,75.78 15.07,75.78 15.72,75.12 15.72,75.08 19.8,71 28.38,71 29.7,69.69 33.88,69.69 35.1,68.46 36.02,68.46 36.68,69.12 36.68,70.04 36.02,70.7 35.4,70.7 34.44,71.66 34.44,72.58 35.4,73.54 64.57,73.54 O5.4 67,72.07 68.12,70.95 76.36,70.95 77.47,69.85 | 77.47,69.85 78.74,68.58 78.74,63.5 79.38,62.87 89.53,62.87 91.11,61.29 91.11,57.66 93.84,54.93 97.47,54.93 97.79,54.61 97.79,39.76 95.07,37.04 95.07,34.27 93.87,33.06 93.87,31.82 94.6,31.08 94.6,29.21 | 94.6,29.21 94.6,28.79 92.3,26.49 91.06,26.49 90.07,25.5 89.91,25.5 89.69,25.29 86.69,25.29 85.31,23.91 | CON3.2 81.75,75.13 81.75,72.22 81.28,71.75 79.01,71.75 78.99,71.78 78.49,71.78 78.13,71.42 78.13,70.51 77.47,69.85 | v72.39,12.7 72.95,13.26 80.73,13.26 82.4,14.93 82.4,16.97 81.74,17.63 80.6,17.63 80.14,18.09 v80.14,21.72 81.28,22.86 84.26,22.86 85.31,23.91 | MINI_VERT.1 v78.11,23.88 | 85.31,23.91 | 94.6,29.21
N$1
  Bottom 0.152: U2.TX0 27.94,16.51 29.21,15.24 29.52,15.24 29.79,15.52 30.53,15.52 33.6,12.45 39.64,12.45 39.7,12.38 40.64,12.38 40.68,12.42 43.52,12.42 43.55,12.45 45.47,12.45 46.12,13.1 46.68,13.1 52.55,7.23 52.55,4.29 53.51,3.33 54.44,3.33 55.09,3.98 55.09,4.93 IC3.5
N$2
  Top 0.305: X5.2 90.11,25.62 90.21,25.62 | X3.3 90.21,25.6 90.21,25.62 | X5.1 90.27,25.56 90.21,25.62
  Bottom 0.305: X5.2 89.91,27.84 89.91,34.86 89.32,35.45 86.38,35.45 85.85,34.92 85.85,34.51 85.03,33.69 83.88,33.69 82.88,34.68 81.42,34.68 80.72,35.38 80.72,35.56 80.54,35.74 SJ_SX3.1
N$3  (via drill 0.35)
  Top 0.152: U3.A5 35.56,35.81 34.92,35.17 34.54,35.17 34.02,34.66 34.02,33.6 34.14,33.48 34.14,32.56 33.26,31.68 33.26,25.35 33.42,25.2 33.38,25.15 33.38,24.38 34.59,23.16 35.97,23.16 38.86,20.27 v45.87,20.27
  Bottom 0.152: R9.1 30.95,34.44 33.48,34.44 35.56,36.52 U3.A5 | v45.87,20.27 51.21,20.27 52.58,18.9 54.56,18.9 55.63,17.83 57.76,17.83 IC3.1
N$4
  Top 0.152: S4.+ 15.24,14.29 15.24,22.86 R4.1
N$5  (via drill 0.35)
  Top 0.152: v46.43,12.5 v48.84,12.5 | SV2.2 80.01,17.78 v73.66,17.78
  Bottom 0.152: R10.1 24.84,24.08 26.06,22.86 26.06,20.32 26.04,20.3 26.04,12.92 27.39,11.56 30.39,11.56 30.97,12.14 39.51,12.14 39.62,12.04 43.57,12.04 43.67,12.14 46,12.14 46.35,12.5 v46.43,12.5 | v48.84,12.5 53.09,8.26 56.5,8.26 56.76,8.51 58.81,8.51 59.33,7.99 59.33,7.25 58.05,5.97 56.76,5.97 56.24,5.45 56.24,4.71 56.76,4.19 63.63,4.19 63.86,4.42 63.86,15.61 64.61,16.36 72.24,16.36 v73.66,17.78
N$6
  Top 0.152: R5.1 23.27,25.63 23.27,23.18 26.04,20.41 26.04,17.35 27.62,15.76 S5.+
N$7
  Bottom 0.152: R6.1 32.32,18.16 36.83,18.16 40.32,14.67 S6.+
N$9  (via drill 0.35)
  Top 0.305: v83.97,37.97 84.67,37.97 87.19,35.45 89.32,35.45 89.9,34.86 89.9,33.29 91.29,31.9 91.86,31.9 92.45,31.31 92.45,30.09 91.44,29.09 X5.3
  Bottom 0.305: v83.97,37.97 83.16,37.97 82.41,37.22 80.44,37.22 SJ_SX4.1
N$10
  Top 0.305: CON4.2 92.08,76.25 91.93,76.1 91.61,76.1 90.88,75.37 LED5.2_DOUT 88.74,75.3 LED3.2-DOUT
N$11
  Bottom 0.152: SJ_NORM.2 30.48,76.2 30.16,75.88 COPY_LED.1 24.41,73.34 23.18,72.12 O1.4
N$12
  Top 0.61: X2.2 43.5,59.37 B1.AC2 R8.2
N$13
  Bottom 0.61: B1.AC1 47.95,61.92 57.77,61.92 58.1,61.59 X2.M X2.1
N$14
  Bottom 0.152: Q1.2 60.17,37.75 58.42,39.5 R31.1
N$15
  Top 0.152: U2.RST 17.78,26.67 JP4.1
N$16  (via drill 0.35)
  Top 0.152: v53.98,22.23 52.91,23.29 52.91,24.57 53.34,25 v53.34,29.21
  Bottom 0.152: IC3.4 59.33,11.71 59.33,17.78 59.33,18.15 59.33,18.63 59.37,18.67 | U3.D5 52.7,37.47 52.7,32.31 52.73,32.28 52.73,29.82 v53.34,29.21 | v53.98,22.23 54.61,22.23 58.17,18.67 59.37,18.67 | R20.2 61.21,18.67 59.37,18.67
N$18
  Bottom 0.152: IC3.6 57.78,5.27 59.64,7.13 59.64,15.47 63.98,19.81 63.98,20.78 63.33,21.44 62.18,21.44 60.91,20.17 57.2,20.17 57.15,20.22 57.05,20.22 54.43,22.83 53.77,22.83 52.47,24.13 U3.RX1
N$19
  Bottom 0.152: R3.1 LED1.A
N$20
  Bottom 0.152: U3.D13 34.61,56.2 25.08,56.2 JP3.1
N$21  (via drill 0.35)
  Top 0.152: v44.45,47.31 OK1.2 43.18,52.07 40.64,52.07 R8.1
  Bottom 0.152: v44.45,47.31 43.31,47.31 NO_OPTO.2
N$22
  Bottom 0.152: O3.4 46.68,72.12 47.8,73.24 52.22,73.24 O4.2
N$23
  Top 0.152: C7.1 73.76,49.53 73.76,47.09 R14.1
  Bottom 0.152: KEYBRD_1.8 80.92,50.75 79.55,49.38 77.47,49.38 | 77.47,49.38 73.91,49.38 73.76,49.53 C7.1 | SJ4.2 76.83,48.74 77.47,49.38
N$24  (via drill 0.35)
  Top 0.152: v2.86,50.8 2.86,50.28 2.07,49.49 2.07,45.76 2.38,45.45 2.38,40.81 3.03,40.16 4.29,40.16 4.92,39.53 4.92,32.67 6.03,31.55 KEYBRD.2
  Bottom 0.152: v2.86,50.8 2.95,50.8 3.56,51.41 5.02,51.41 5.69,52.07 7.62,52.07 11.16,55.61 11.16,57.52 11.68,58.03 13.34,58.03 14.12,58.82 14.12,61.67 14.94,62.48 61.34,62.48 64.92,58.9 64.92,57.32 65.58,56.67 66.9,56.67 68.04,55.52 69.83,55.52 71.38,53.98 76.2,53.98 76.52,54.29 76.99,54.76 78.89,54.76 79.54,55.42 79.54,56.34 78.42,57.46 KEYBRD_1.1
N$25  (via drill 0.35)
  Top 0.152: KEYBRD.8 7.3,16.51 7.3,39.05 6.19,40.16 5.57,40.16 4.61,41.12 4.61,44.28 3.96,44.93 3.33,44.93 2.38,45.88 2.38,49.36 2.54,49.52 2.54,49.53 v3.81,50.8 | v49.07,55.63 52.07,55.63 52.98,55.63 54.4,57.05 61.16,57.05 65.56,61.44 71.28,61.44 78.42,54.3 KEYBRD_1.5
  Bottom 0.152: v3.81,50.8 4.85,50.8 5.81,51.77 7.75,51.77 12.25,56.27 24.58,56.27 24.96,55.89 26.02,55.89 26.4,55.51 26.4,54.24 26.99,53.66 36.51,53.66 37.15,54.29 37.15,54.93 38.05,55.83 38.1,55.78 48.92,55.78 v49.07,55.63
N$27  (via drill 0.35)
  Top 0.152: v54.4,46.84 54.4,45.54 53.98,45.11 52.12,45.11 51.82,45.41 47.65,45.41 45.87,43.64 45.87,42.06 45.72,41.91 42.22,41.91 41.91,41.6 41.91,38.86 v42.52,38.25
  Bottom 0.152: U2.A6 13.97,35.56 15.56,35.56 17.94,33.18 18.47,33.18 18.86,32.79 22.85,32.79 23.46,33.41 29.46,33.41 30.97,31.9 33.48,31.9 34.99,33.41 36.58,33.41 37.1,33.92 37.1,34.98 36.98,35.1 36.98,36.35 38.89,38.25 v42.52,38.25 | v54.4,46.84 54.46,46.84 57.78,50.16 62.87,50.16 64.85,48.18 74.15,48.18 75.16,47.17 SJ4.1
N$28
  Bottom 0.152: U3.D10 47.94,49.21 37.78,49.21 36.51,50.48 34.92,50.48 32.45,52.95 22.47,52.95 JP4.2
N$31
  Top 0.152: U3.TX0 50.9,21.49 50.9,21.18 53.19,18.9 54.56,18.9 57.76,15.7 57.76,15.24 IC3.2
N$33
  Bottom 0.152: R2.1 43.28,19.05 43.59,18.75 49.52,18.75 50.34,17.93 52.24,17.93 53.51,16.66 55.24,16.66 56.24,15.67 56.24,14.25 IC3.3
N$34
  Bottom 0.152: U2.RX1 29.21,24.13 33.07,20.27 43.59,20.27 44.81,19.05 R2.2
N$35
  Bottom 0.152: O2.2 34.34,70.8 COPY_LED.2 32.26,72.9 SJ_NORM.1
N$37
  Bottom 0.152: O4.4 56.84,72.12 57.96,73.24 62.34,73.24 O5.2
N$38
  Top 0.152: R23.1 IC2.2 45.72,30.48 45.72,26.98 44.6,25.86 44.6,25.24 43.49,24.13 41.91,24.13 IC2.6
  Bottom 0.152: R24.2 R23.1
N$39
  Top 0.152: R30.1 43.18,37.14 42.06,36.02 42.06,34.44 IC2.3
  Bottom 0.152: SJ_SX1.1 40.19,31.75 40.64,32.2 IC2.3 41.76,34.14 48.77,34.14 49.53,33.38 51.21,33.38 52.43,32.16 52.43,28.85 53.03,28.25 54.05,28.25 57.76,24.54 57.76,21.59 R25.1 | R29.2 R30.1
N$40
  Bottom 0.457: 77.78,30.86 77.84,30.8 85.74,30.8 86.39,31.45 87.59,31.45 88.44,30.6 88.44,29.83 X5.4 | SJ_SX5.1 76.83,37.59 77.08,37.34 77.63,37.34 77.85,37.12 77.85,35.27 77.78,35.2 77.78,30.86 | 77.78,30.86 77.78,30.1 78.11,29.77 78.11,29.21 SJ_LN1.1
N$42
  Top 0.152: IC2.5 39.37,24.13 R28.1
  Bottom 0.152: IC2.5 38.1,26.04 40.01,27.94 SJ_SX2.1
N$58
  Bottom 0.152: O2.4 36.68,73.24 42.06,73.24 O3.2
OSC1
  Top 0.152: C15.1 58.37,28.04 58.37,29.26 56.52,31.11 IC4.8 55.09,33.18 X6.2
OSC2
  Top 0.152: C14.1 60.96,29.87 59.13,31.7 IC4.7 59.05,31.93 56.52,34.47 56.52,39.08 X6.1
PE
  Top 0.152: X3.PE 97.07,27.6 97.07,32.48 X3.PE@
POWER2
  Top 1.016: O5.6 63.18,77.47 55.88,77.47 | 35.56,77.47 25.04,77.47 O1.6 19.68,74.66 INP.6 | 35.56,77.47 45.72,77.47 | 45.72,77.47 55.88,77.47 | O4.6 55.88,77.47 | O3.6 45.72,77.47 | O2.6 35.56,77.47
RESET_K  (via drill 0.35)
  Top 0.152: v25.08,43.18 24.75,43.51 24.75,45.12 24.13,45.74 24.13,49.53 R3.2 25.45,50.9 25.45,56.69 30.94,62.18 71.17,62.18 76.2,57.15 78.73,57.15 79.84,56.04 79.84,55.42 80.96,54.3 KEYBRD_1.6 | v8.57,18.41 8.57,25.08 9.55,26.06 10.41,26.06 10.79,26.45 10.79,40.64 12.06,41.91 U2.A3
  Bottom 0.152: KEY_80.10 4.76,42.55 12.06,42.55 U2.A3 13.97,43.18 v25.08,43.18 | KEYBRD.6 6.67,18.41 v8.57,18.41
RXCAN
  Top 0.152: IC4.2 73.03,30.48 76.2,30.48 76.5,30.79 76.5,37.79 74.3,40 IC5.2 72.92,42.33 63.4,42.33 60.48,45.25 60.48,49.36 62.23,51.11 CAN2.11
SCL
  Top 0.152: 14.29,36.83 U2.A5 | 14.29,36.83 R27.1 C9.1 | KEY_80.12 4.61,47.47 6.5,47.47 6.98,46.99 8.89,46.99 9.55,47.65 9.55,48.67 9.91,49.03 10.41,49.03 10.77,48.67 10.77,45.75 10.79,45.72 10.79,43.18 11.18,42.79 13.72,42.79 14.29,42.23 14.29,36.83
SDA
  Bottom 0.152: R12.1 U2.A4
SX_POWER_INP  (via drill 0.35)
  Top 0.61: v52.73,56.24 52.56,56.4 52.56,57.61 51.91,58.26 46.83,58.26 B1.+ | C4.1 55.88,53.34 55.88,55.88 56.46,56.46 62.18,56.46 C2.1 67.94,60.33 IC1.IN 72.39,59.05 77.08,54.37 77.08,44.21 v78.11,43.18
  Bottom 0.406: 78.11,37.91
  Bottom 0.61: D1.C 71.12,59.05 IC1.IN | v52.73,56.24 55.56,53.4 C4.1 | SJ_SX3.2 78.11,37.91 v78.11,43.18
SX_T0
  Top 0.152: X3.1 87.01,37.66 87.75,37.66 91.44,33.97 J2.6
  Bottom 0.152: R28.2 45.72,22.86 46.84,23.98 46.84,26.52 47.14,26.82 48.72,26.82 49.84,27.94 53.92,27.94 55.45,26.42 55.45,22.35 57.32,20.47 60.79,20.47 62.06,21.74 77.53,21.74 80.01,24.22 80.01,25.4 80.39,25.78 81.65,25.78 82.24,26.36 85.51,26.36 85.81,26.06 87.92,26.06 88.39,25.59 89.57,25.59 90.77,26.79 92.17,26.79 94.21,28.82 94.21,30.95 91.98,33.18 J2.6
SX_T1
  Top 0.152: J2.4 91.44,30.86 89.16,33.14 87.63,33.14 85.68,35.08 X3.4
  Bottom 0.152: R25.2 60.78,22.05 77.41,22.05 79.7,24.34 79.7,27.69 79.76,27.74 | Q1.3 61.44,38.27 62.38,39.21 62.38,42.5 61.59,43.29 61.59,44.2 62.03,44.63 62.83,44.63 63.39,45.19 74.41,45.19 75.09,45.87 84.94,45.87 85.09,45.72 85.09,40.45 84.26,39.62 84.26,39.12 85.09,38.29 85.09,35.72 X3.4 | J2.4 91.44,29.42 90.51,28.48 90.51,27.12 89.29,25.9 88.51,25.9 88.05,26.36 85.94,26.36 85.63,26.67 83.19,26.67 81.75,28.11 80.82,28.11 80.46,27.74 79.76,27.74 | SJ_LN1.2 79.76,27.74
TXCAN
  Top 0.152: IC4.1 74.93,31.75 76.2,33.02 76.2,36.83 74.61,38.42 IC5.3 73.15,38.42 71.98,37.25 63.4,37.25 62.39,38.25 60.5,38.25 59.69,39.06 CAN2.10

## Text on the board
Top: Top | GND
Bottom: Bot | +5V
tPlace: +
bPlace: https://www.stummiforum.de/viewtopic.php?f=7&t=165060 | https://wiki.mobaledlib.de | by Hardi und Jürgen (fromue) | Main Module
tNames: 5V | Mini- / distributor | In | 5050 / 3535 | 5V / Out / GND | Input | Normal | GND | 5V | Ver.: | In | 5V / Out / GND | 5050 / 3535 | by Hardi | GND | DCC | Mä-CAN | DCC Nano | CAN | LEDs Main / Module | LED Nano | Selectrix | GND +5V | GND +5V | LED 0 | + | <= | => | L+R / =All | + | Long / =ESC | + | Ver.: | LED N | LED / Test | Sim / Inp. | Inp. / Test | MobaLedLib | by Hardi
bNames: <- für Alf | -Arduino_fuer_LEDs | 101a- | by Hardi | MobaLedLib
Name: 1 LN | 2 LN | 2 SX | 1 SX